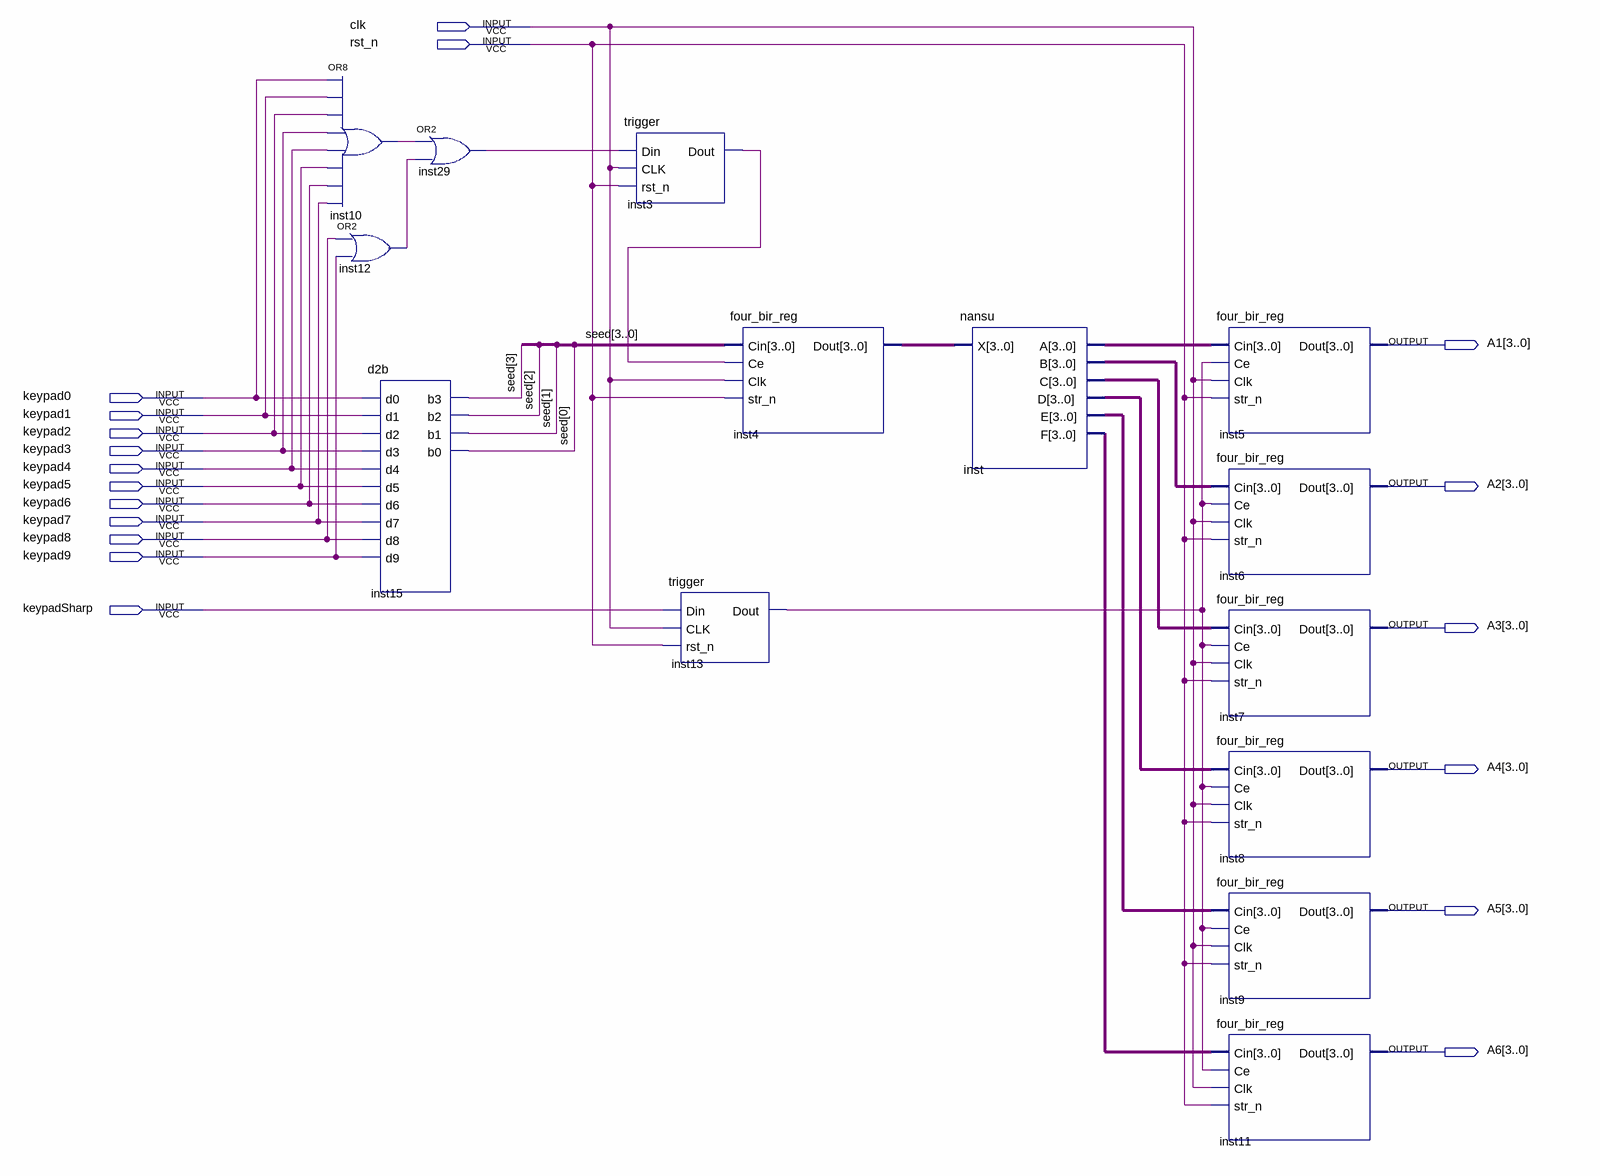
[diagram p0: schematic sheet]
// Quartus schematic stepZero.bdf as structural Verilog: 14 symbols, 19 pins
module stepZero (
  input  clk,
  input  rst_n,
  input  keypad0,
  input  keypad1,
  input  keypad2,
  input  keypad3,
  input  keypad4,
  input  keypad5,
  input  keypad6,
  input  keypad7,
  input  keypad8,
  input  keypad9,
  input  keypadSharp,
  output [3:0] A1,
  output [3:0] A2,
  output [3:0] A3,
  output [3:0] A4,
  output [3:0] A5,
  output [3:0] A6
);

  wire inst3_dout, inst10_out, inst12_out, inst13_dout, inst29_out;
  wire [3:0] inst4_dout, inst_a, inst_b, inst_c, inst_d, inst_e, inst_f, seed;

  or inst10 (inst10_out, keypad0, keypad1, keypad2, keypad3, keypad4, keypad5, keypad6, keypad7);
  or inst12 (inst12_out, keypad8, keypad9);
  d2b inst15 (
    .d0(keypad0), .d1(keypad1), .d2(keypad2), .d3(keypad3), .d4(keypad4), .d5(keypad5), .d6(keypad6),
    .d7(keypad7), .d8(keypad8), .d9(keypad9), .b3(seed[3]), .b2(seed[2]), .b1(seed[1]), .b0(seed[0]));
  or inst29 (inst29_out, inst10_out, inst12_out);
  trigger inst3 (.Din(inst29_out), .CLK(clk), .rst_n(rst_n), .Dout(inst3_dout));
  trigger inst13 (.Din(keypadSharp), .CLK(clk), .rst_n(rst_n), .Dout(inst13_dout));
  four_bir_reg inst4 (.Cin(seed), .Ce(inst3_dout), .Clk(clk), .str_n(rst_n), .Dout(inst4_dout));
  nansu inst (.X(inst4_dout), .A(inst_a), .B(inst_b), .C(inst_c), .D(inst_d), .E(inst_e), .F(inst_f));
  four_bir_reg inst5 (.Cin(inst_a), .Ce(inst13_dout), .Clk(clk), .str_n(rst_n), .Dout(A1));
  four_bir_reg inst6 (.Cin(inst_b), .Ce(inst13_dout), .Clk(clk), .str_n(rst_n), .Dout(A2));
  four_bir_reg inst7 (.Cin(inst_c), .Ce(inst13_dout), .Clk(clk), .str_n(rst_n), .Dout(A3));
  four_bir_reg inst8 (.Cin(inst_d), .Ce(inst13_dout), .Clk(clk), .str_n(rst_n), .Dout(A4));
  four_bir_reg inst9 (.Cin(inst_e), .Ce(inst13_dout), .Clk(clk), .str_n(rst_n), .Dout(A5));
  four_bir_reg inst11 (.Cin(inst_f), .Ce(inst13_dout), .Clk(clk), .str_n(rst_n), .Dout(A6));
endmodule
